# Altium schematic sheet ADC_ADC084S021_SPI.SchDoc: ADC084S021 8-Bit ADC IC
size A4; DocumentNumber: 26; SheetNumber: 27; SheetTotal: 77
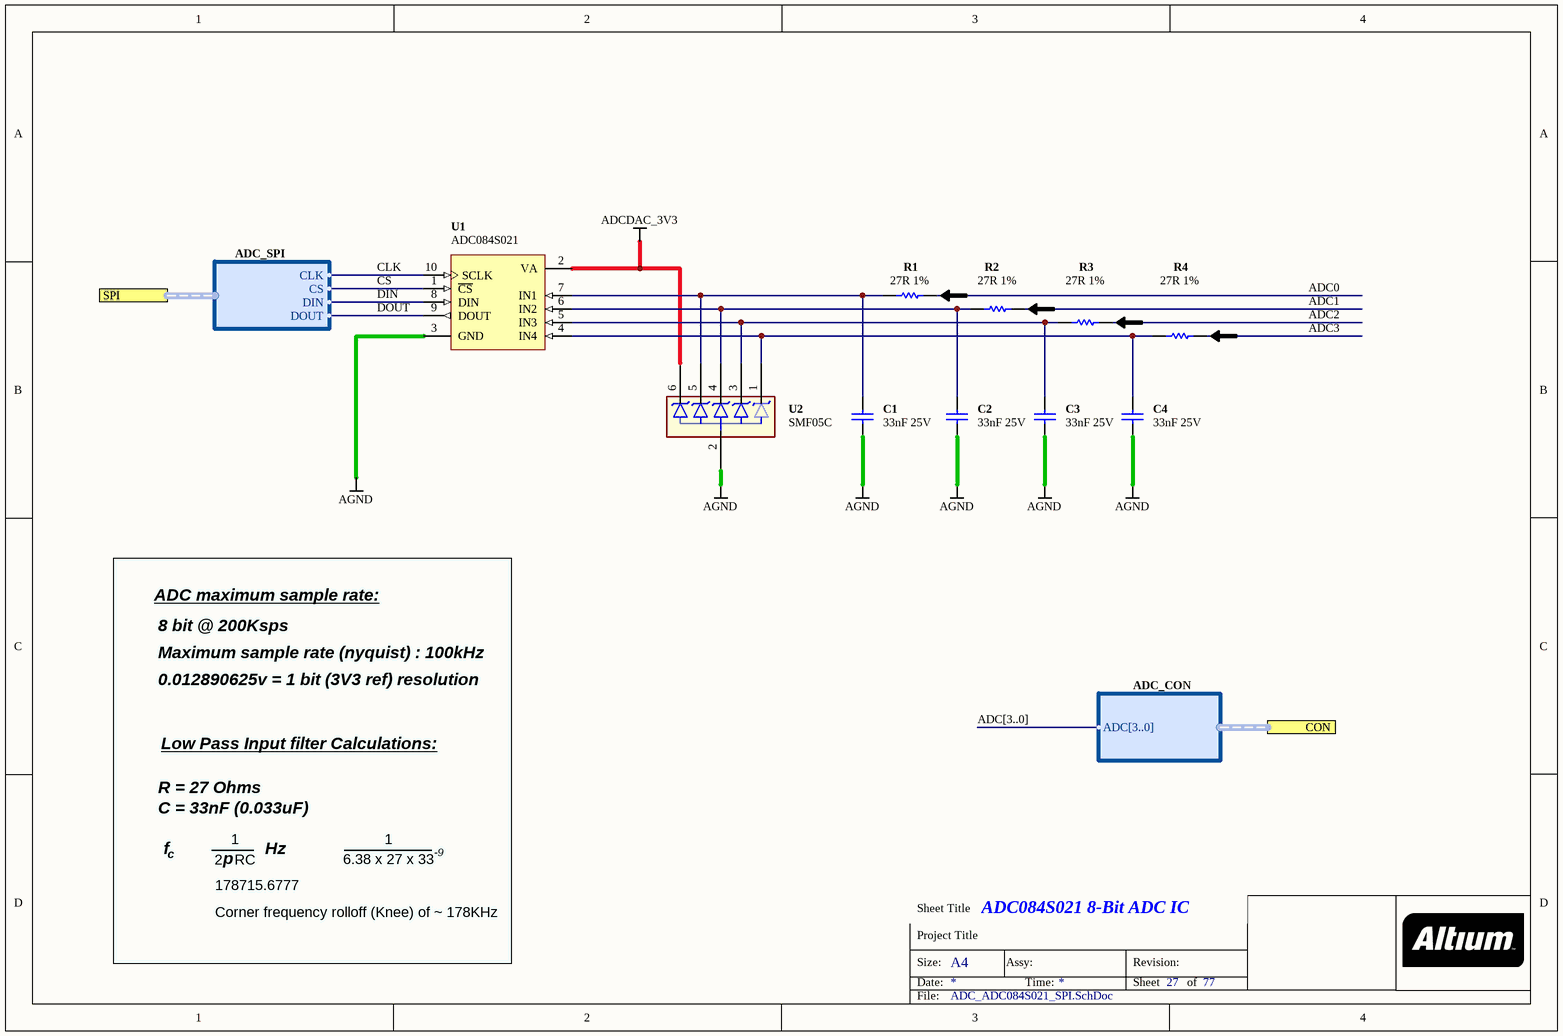
[diagram p0: ADC_ADC084S021_SPI.SchDoc]

## Parts
C1  33nF 25V  [CAPC1005-STAR]
C2  33nF 25V  [CAPC1005-STAR]
C3  33nF 25V  [CAPC1005-STAR]
C4  33nF 25V  [CAPC1005-STAR]
R1  27R 1%  [RESC1005-STAR]
R2  27R 1%  [RESC1005-STAR]
R3  27R 1%  [RESC1005-STAR]
R4  27R 1%  [RESC1005-STAR]
U1  ADC084S021  [TSSOP50P490-10AN]
U2  SMF05C  [SC70_6L]

## Ports
CON (harness ADC_CON), SPI (harness ADC_SPI)

## Harnesses
ADC_SPI: CS, CLK, DIN, DOUT
ADC_CON: ADC[3..0]

## Nets
ADCDAC_3V3: U1.2(VA) U2.6
AGND: C1.2 C2.2 C3.2 C4.2 U1.3(GND) U2.2
ADC0: R1.1
ADC1: R2.1
ADC2: R3.1
ADC3: R4.1
CLK: U1.10(SCLK) ; port SPI.CLK
CS: U1.1(~{CS}) ; port SPI.CS
DIN: U1.8(DIN) ; port SPI.DIN
DOUT: U1.9(DOUT) ; port SPI.DOUT
NetC1_1: C1.1 R1.2 U1.7(IN1) U2.5
NetC2_1: C2.1 R2.2 U1.6(IN2) U2.4
NetC3_1: C3.1 R3.2 U1.5(IN3) U2.3
NetC4_1: C4.1 R4.2 U1.4(IN4) U2.1

## Buses and harness runs
bus ADC[3..0]

## Notes on the sheet
- ADC maximum sample rate:
- 8 bit @ 200Ksps
- Maximum sample rate (nyquist) : 100kHz
- 0.012890625v = 1 bit (3V3 ref) resolution
- Low Pass Input filter Calculations:
- R = 27 Ohms
- C = 33nF (0.033uF)
- f
- 1
- Hz
- -9
- c
- 2   RC
- 178715.6777
- Corner frequency rolloff (Knee) of ~ 178KHz
- p
- 6.38 x 27 x 33
- Sheet Title
- Project Title
- Size:
- Date:
- A4
- Assy:
- Time:
- Revision:
- Sheet
- of
- File:

## Library data of the parts
C1-C4 = D-101-0133: Capacitor, Ceramic, 33nF 10% 25V 0402 (1005) X7R; Polarity: Non-Polarized; Category: Capacitor; Capacitance: 33 nF; Dielectric: X7R; Mounting Technology: Surface Mount; Rated Voltage: 25 V; Status: Production; Technology: Ceramic; Tolerance: 10 %
R1-R4 = D-100-0108: Resistor, 27R 1% 0402 (1005); Power Rating: 63 mW; Category: Resistor; Mounting Technology: Surface Mount; Resistance: 27 R; Status: Production; Tolerance: 1 %
U1 = D-220-0004: ADC084S021, 8-bit ADC, 4 Channel, 50 ksps to 200ksps, SPI; Bit Width: 8Bits; Max Sample Frequency: 100KHz; Supply Voltage: 2.7 to 5.25V; Digital Interface: SPI; Mounting Technology: Surface Mount; Status: Unreleased; Temperature Range: -40 to +85 degC; Category: IC-ADC
U2 = D-157-0000: TVS Diode Array  For ESD and Latch-Up Protection; Junction Capacitance: 130 pF; Peak Pulse Current: 8 A; Peak Pulse Power: 100 W; Reverse Breakdown Voltage: 6 V; Status: Unreleased; Category: Diode-Protection